# EAGLE design 2high (EAGLE 6.6.0)
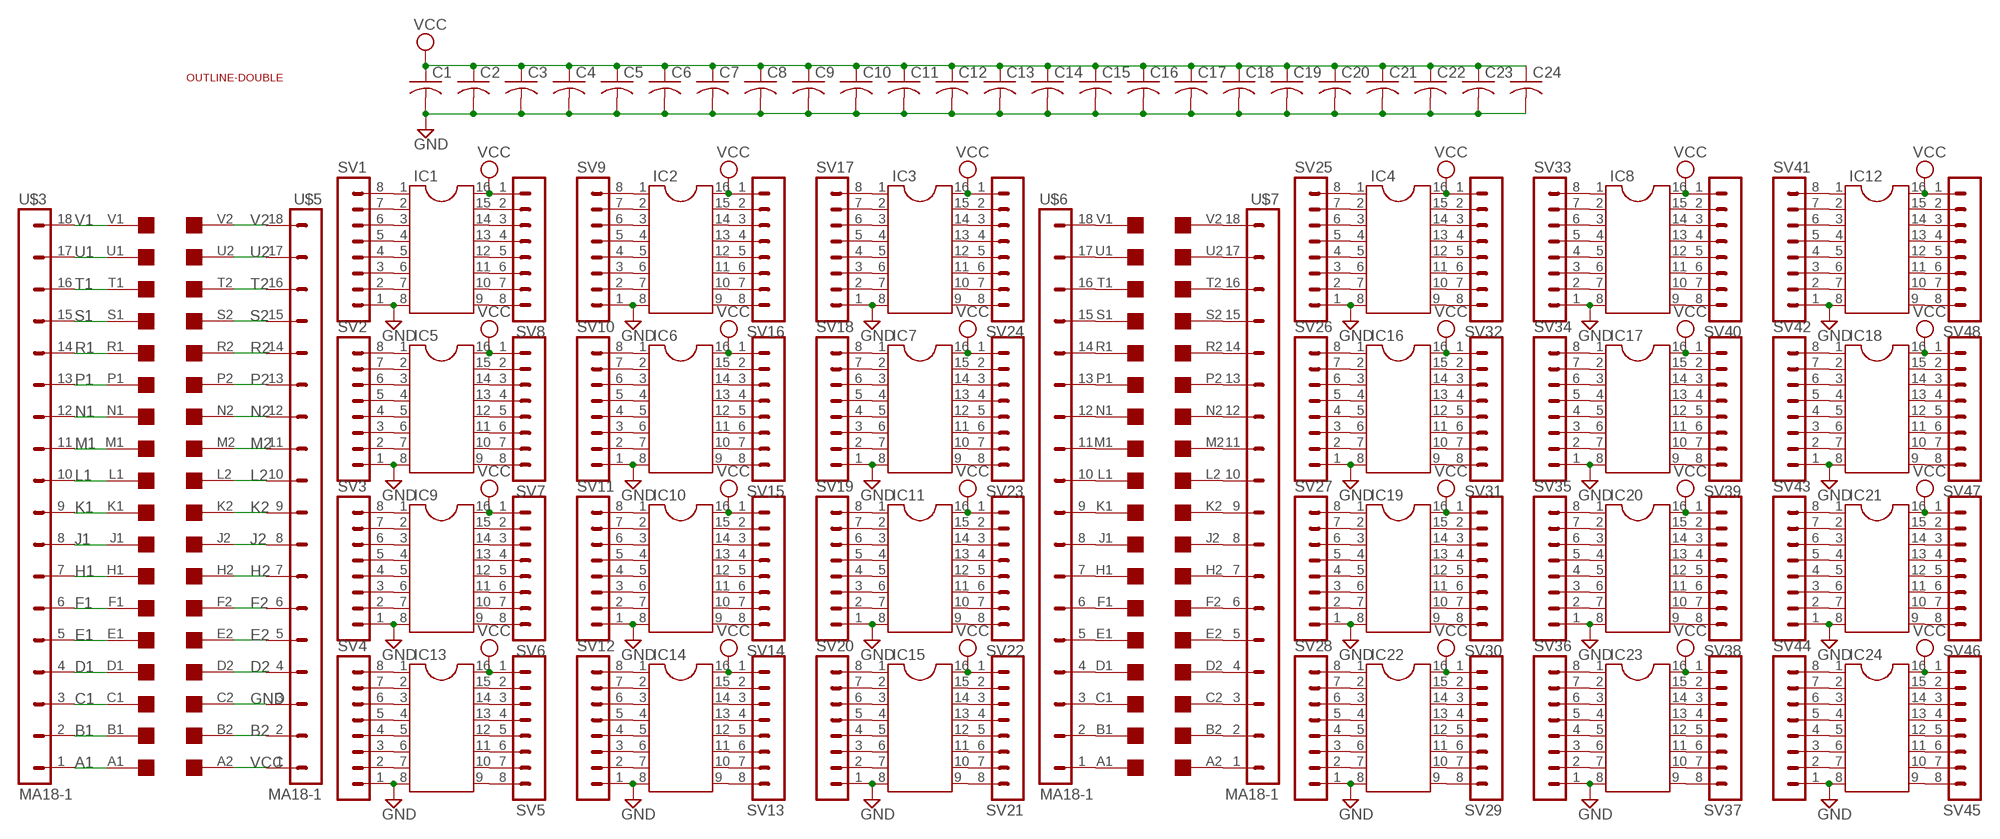
[diagram p0: schematic, sheet 1]

## Parts
C1  C-US050-025X075  [C050-025X075]
C2  C-US050-025X075  [C050-025X075]
C3  C-US050-025X075  [C050-025X075]
C4  C-US050-025X075  [C050-025X075]
C5  C-US050-025X075  [C050-025X075]
C6  C-US050-025X075  [C050-025X075]
C7  C-US050-025X075  [C050-025X075]
C8  C-US050-025X075  [C050-025X075]
C9  C-US050-025X075  [C050-025X075]
C10  C-US050-025X075  [C050-025X075]
C11  C-US050-025X075  [C050-025X075]
C12  C-US050-025X075  [C050-025X075]
C13  C-US050-025X075  [C050-025X075]
C14  C-US050-025X075  [C050-025X075]
C15  C-US050-025X075  [C050-025X075]
C16  C-US050-025X075  [C050-025X075]
C17  C-US050-025X075  [C050-025X075]
C18  C-US050-025X075  [C050-025X075]
C19  C-US050-025X075  [C050-025X075]
C20  C-US050-025X075  [C050-025X075]
C21  C-US050-025X075  [C050-025X075]
C22  C-US050-025X075  [C050-025X075]
C23  C-US050-025X075  [C050-025X075]
C24  C-US050-025X075  [C050-025X075]
IC1  DIL16  [DIL16]
IC2  DIL16  [DIL16]
IC3  DIL16  [DIL16]
IC4  DIL16  [DIL16]
IC5  DIL16  [DIL16]
IC6  DIL16  [DIL16]
IC7  DIL16  [DIL16]
IC8  DIL16  [DIL16]
IC9  DIL16  [DIL16]
IC10  DIL16  [DIL16]
IC11  DIL16  [DIL16]
IC12  DIL16  [DIL16]
IC13  DIL16  [DIL16]
IC14  DIL16  [DIL16]
IC15  DIL16  [DIL16]
IC16  DIL16  [DIL16]
IC17  DIL16  [DIL16]
IC18  DIL16  [DIL16]
IC19  DIL16  [DIL16]
IC20  DIL16  [DIL16]
IC21  DIL16  [DIL16]
IC22  DIL16  [DIL16]
IC23  DIL16  [DIL16]
IC24  DIL16  [DIL16]
SV1  MA08-1  [MA08-1]
SV2  MA08-1  [MA08-1]
SV3  MA08-1  [MA08-1]
SV4  MA08-1  [MA08-1]
SV5  MA08-1  [MA08-1]
SV6  MA08-1  [MA08-1]
SV7  MA08-1  [MA08-1]
SV8  MA08-1  [MA08-1]
SV9  MA08-1  [MA08-1]
SV10  MA08-1  [MA08-1]
SV11  MA08-1  [MA08-1]
SV12  MA08-1  [MA08-1]
SV13  MA08-1  [MA08-1]
SV14  MA08-1  [MA08-1]
SV15  MA08-1  [MA08-1]
SV16  MA08-1  [MA08-1]
SV17  MA08-1  [MA08-1]
SV18  MA08-1  [MA08-1]
SV19  MA08-1  [MA08-1]
SV20  MA08-1  [MA08-1]
SV21  MA08-1  [MA08-1]
SV22  MA08-1  [MA08-1]
SV23  MA08-1  [MA08-1]
SV24  MA08-1  [MA08-1]
SV25  MA08-1  [MA08-1]
SV26  MA08-1  [MA08-1]
SV27  MA08-1  [MA08-1]
SV28  MA08-1  [MA08-1]
SV29  MA08-1  [MA08-1]
SV30  MA08-1  [MA08-1]
SV31  MA08-1  [MA08-1]
SV32  MA08-1  [MA08-1]
SV33  MA08-1  [MA08-1]
SV34  MA08-1  [MA08-1]
SV35  MA08-1  [MA08-1]
SV36  MA08-1  [MA08-1]
SV37  MA08-1  [MA08-1]
SV38  MA08-1  [MA08-1]
SV39  MA08-1  [MA08-1]
SV40  MA08-1  [MA08-1]
SV41  MA08-1  [MA08-1]
SV42  MA08-1  [MA08-1]
SV43  MA08-1  [MA08-1]
SV44  MA08-1  [MA08-1]
SV45  MA08-1  [MA08-1]
SV46  MA08-1  [MA08-1]
SV47  MA08-1  [MA08-1]
SV48  MA08-1  [MA08-1]
U$1  OUTLINE-DOUBLE  [DOUBLE]
U$2  EDGE-2CONNECTOR  [EDGE-CON2]
U$3  MA18-1  [MA18-1]
U$4  EDGE-2CONNECTOR  [EDGE-CON2]
U$5  MA18-1  [MA18-1]
U$6  MA18-1  [MA18-1]
U$7  MA18-1  [MA18-1]

## Nets
A1: U$3.1 U$4.A1
B1: U$3.2 U$4.B1
B2: U$4.B2 U$5.2
C1: U$3.3 U$4.C1
D1: U$3.4 U$4.D1
D2: U$4.D2 U$5.4
E1: U$3.5 U$4.E1
E2: U$4.E2 U$5.5
F1: U$3.6 U$4.F1
F2: U$4.F2 U$5.6
GND: C1.2 C2.2 C3.2 C4.2 C5.2 C6.2 C7.2 C8.2 C9.2 C10.2 C11.2 C12.2 C13.2 C14.2 C15.2 C16.2 C17.2 C18.2 C19.2 C20.2 C21.2 C22.2 C23.2 C24.2 IC1.8 IC2.8 IC3.8 IC4.8 IC5.8 IC6.8 IC7.8 IC8.8 IC9.8 IC10.8 IC11.8 IC12.8 IC13.8 IC14.8 IC15.8 IC16.8 IC17.8 IC18.8 IC19.8 IC20.8 IC21.8 IC22.8 IC23.8 IC24.8 SV1.1 SV2.1 SV3.1 SV4.1 SV9.1 SV10.1 SV11.1 SV12.1 SV17.1 SV18.1 SV19.1 SV20.1 SV25.1 SV26.1 SV27.1 SV28.1 SV33.1 SV34.1 SV35.1 SV36.1 SV41.1 SV42.1 SV43.1 SV44.1 U$4.C2 U$5.3
H1: U$3.7 U$4.H1
H2: U$4.H2 U$5.7
J1: U$3.8 U$4.J1
J2: U$4.J2 U$5.8
K1: U$3.9 U$4.K1
K2: U$4.K2 U$5.9
L1: U$3.10 U$4.L1
L2: U$4.L2 U$5.10
M1: U$3.11 U$4.M1
M2: U$4.M2 U$5.11
N1: U$3.12 U$4.N1
N2: U$4.N2 U$5.12
N$1: IC1.7 SV1.2
N$2: IC1.6 SV1.3
N$3: IC1.5 SV1.4
N$4: IC1.4 SV1.5
N$5: IC1.3 SV1.6
N$6: IC1.2 SV1.7
N$7: IC1.1 SV1.8
N$8: IC5.7 SV2.2
N$9: IC5.6 SV2.3
N$10: IC5.5 SV2.4
N$11: IC5.4 SV2.5
N$12: IC5.3 SV2.6
N$13: IC5.2 SV2.7
N$14: IC5.1 SV2.8
N$15: IC9.7 SV3.2
N$16: IC9.6 SV3.3
N$17: IC9.5 SV3.4
N$18: IC9.4 SV3.5
N$19: IC9.3 SV3.6
N$20: IC9.2 SV3.7
N$21: IC9.1 SV3.8
N$22: IC13.7 SV4.2
N$23: IC13.6 SV4.3
N$24: IC13.5 SV4.4
N$25: IC13.4 SV4.5
N$26: IC13.3 SV4.6
N$27: IC13.2 SV4.7
N$28: IC13.1 SV4.8
N$29: IC2.1 SV9.8
N$30: IC2.2 SV9.7
N$31: IC2.3 SV9.6
N$32: IC2.4 SV9.5
N$33: IC2.5 SV9.4
N$34: IC2.6 SV9.3
N$35: IC2.7 SV9.2
N$36: IC6.1 SV10.8
N$37: IC6.2 SV10.7
N$38: IC6.3 SV10.6
N$39: IC6.4 SV10.5
N$40: IC6.5 SV10.4
N$41: IC6.6 SV10.3
N$42: IC6.7 SV10.2
N$43: IC10.1 SV11.8
N$44: IC10.2 SV11.7
N$45: IC10.3 SV11.6
N$46: IC10.4 SV11.5
N$47: IC10.5 SV11.4
N$48: IC10.6 SV11.3
N$49: IC10.7 SV11.2
N$50: IC14.1 SV12.8
N$51: IC14.2 SV12.7
N$52: IC14.3 SV12.6
N$53: IC14.4 SV12.5
N$54: IC14.5 SV12.4
N$55: IC14.6 SV12.3
N$56: IC14.7 SV12.2
N$57: IC6.15 SV15.2
N$58: IC6.14 SV15.3
N$59: IC6.13 SV15.4
N$60: IC6.12 SV15.5
N$61: IC6.11 SV15.6
N$62: IC6.10 SV15.7
N$63: IC6.9 SV15.8
N$64: IC10.15 SV14.2
N$65: IC10.14 SV14.3
N$66: IC10.13 SV14.4
N$67: IC10.12 SV14.5
N$68: IC10.11 SV14.6
N$69: IC10.10 SV14.7
N$70: IC10.9 SV14.8
N$71: IC1.9 SV8.8
N$72: IC1.10 SV8.7
N$73: IC1.11 SV8.6
N$74: IC1.12 SV8.5
N$75: IC1.13 SV8.4
N$76: IC1.14 SV8.3
N$77: IC1.15 SV8.2
N$78: IC5.9 SV7.8
N$79: IC5.10 SV7.7
N$80: IC5.11 SV7.6
N$81: IC5.12 SV7.5
N$82: IC5.13 SV7.4
N$83: IC5.14 SV7.3
N$84: IC5.15 SV7.2
N$85: IC2.15 SV16.2
N$86: IC2.14 SV16.3
N$87: IC2.13 SV16.4
N$88: IC2.12 SV16.5
N$89: IC2.11 SV16.6
N$90: IC2.10 SV16.7
N$91: IC2.9 SV16.8
N$92: IC13.15 SV5.2
N$93: IC13.14 SV5.3
N$94: IC13.13 SV5.4
N$95: IC13.12 SV5.5
N$96: IC13.11 SV5.6
N$97: IC13.10 SV5.7
N$98: IC13.9 SV5.8
N$99: IC9.15 SV6.2
N$100: IC9.14 SV6.3
N$101: IC9.13 SV6.4
N$102: IC9.12 SV6.5
N$103: IC9.11 SV6.6
N$104: IC9.10 SV6.7
N$105: IC9.9 SV6.8
N$106: IC14.15 SV13.2
N$107: IC14.14 SV13.3
N$108: IC14.13 SV13.4
N$109: IC14.12 SV13.5
N$110: IC14.11 SV13.6
N$111: IC14.10 SV13.7
N$112: IC14.9 SV13.8
N$113: IC3.7 SV17.2
N$114: IC3.6 SV17.3
N$115: IC3.5 SV17.4
N$116: IC3.4 SV17.5
N$117: IC3.3 SV17.6
N$118: IC3.2 SV17.7
N$119: IC3.1 SV17.8
N$120: IC7.7 SV18.2
N$121: IC7.6 SV18.3
N$122: IC7.5 SV18.4
N$123: IC7.4 SV18.5
N$124: IC7.3 SV18.6
N$125: IC7.2 SV18.7
N$126: IC7.1 SV18.8
N$127: IC11.7 SV19.2
N$128: IC11.6 SV19.3
N$129: IC11.5 SV19.4
N$130: IC11.4 SV19.5
N$131: IC11.3 SV19.6
N$132: IC11.2 SV19.7
N$133: IC11.1 SV19.8
N$134: IC15.7 SV20.2
N$135: IC15.6 SV20.3
N$136: IC15.5 SV20.4
N$137: IC15.4 SV20.5
N$138: IC15.3 SV20.6
N$139: IC15.2 SV20.7
N$140: IC15.1 SV20.8
N$141: IC15.15 SV21.2
N$142: IC15.14 SV21.3
N$143: IC15.13 SV21.4
N$144: IC15.12 SV21.5
N$145: IC15.11 SV21.6
N$146: IC15.10 SV21.7
N$147: IC15.9 SV21.8
N$148: IC11.15 SV22.2
N$149: IC11.14 SV22.3
N$150: IC11.13 SV22.4
N$151: IC11.12 SV22.5
N$152: IC11.11 SV22.6
N$153: IC11.10 SV22.7
N$154: IC11.9 SV22.8
N$155: IC7.15 SV23.2
N$156: IC7.14 SV23.3
N$157: IC7.13 SV23.4
N$158: IC7.12 SV23.5
N$159: IC7.11 SV23.6
N$160: IC7.10 SV23.7
N$161: IC7.9 SV23.8
N$162: IC3.15 SV24.2
N$163: IC3.14 SV24.3
N$164: IC3.13 SV24.4
N$165: IC3.12 SV24.5
N$166: IC3.11 SV24.6
N$167: IC3.10 SV24.7
N$168: IC3.9 SV24.8
N$169: U$2.A2 U$7.1
N$170: U$2.A1 U$6.1
N$171: U$2.B1 U$6.2
N$172: U$2.B2 U$7.2
N$173: U$2.C2 U$7.3
N$174: U$2.C1 U$6.3
N$175: U$2.D1 U$6.4
N$176: U$2.D2 U$7.4
N$177: U$2.E2 U$7.5
N$178: U$2.E1 U$6.5
N$179: U$2.F1 U$6.6
N$180: U$2.F2 U$7.6
N$181: U$2.H2 U$7.7
N$182: U$2.H1 U$6.7
N$183: U$2.J1 U$6.8
N$184: U$2.J2 U$7.8
N$185: U$2.K2 U$7.9
N$186: U$2.K1 U$6.9
N$187: U$2.L1 U$6.10
N$188: U$2.L2 U$7.10
N$189: U$2.M2 U$7.11
N$190: U$2.M1 U$6.11
N$191: U$2.N1 U$6.12
N$192: U$2.P1 U$6.13
N$193: U$2.P2 U$7.13
N$194: U$2.N2 U$7.12
N$195: U$2.V1 U$6.18
N$196: U$2.U1 U$6.17
N$197: U$2.T1 U$6.16
N$198: U$2.S1 U$6.15
N$199: U$2.R1 U$6.14
N$200: U$2.V2 U$7.18
N$201: U$2.U2 U$7.17
N$202: U$2.T2 U$7.16
N$203: U$2.S2 U$7.15
N$204: U$2.R2 U$7.14
N$205: IC4.7 SV25.2
N$206: IC4.6 SV25.3
N$207: IC4.5 SV25.4
N$208: IC4.4 SV25.5
N$209: IC4.3 SV25.6
N$210: IC4.2 SV25.7
N$211: IC4.1 SV25.8
N$212: IC16.7 SV26.2
N$213: IC16.6 SV26.3
N$214: IC16.5 SV26.4
N$215: IC16.4 SV26.5
N$216: IC16.3 SV26.6
N$217: IC16.2 SV26.7
N$218: IC16.1 SV26.8
N$219: IC19.7 SV27.2
N$220: IC19.6 SV27.3
N$221: IC19.5 SV27.4
N$222: IC19.4 SV27.5
N$223: IC19.3 SV27.6
N$224: IC19.2 SV27.7
N$225: IC19.1 SV27.8
N$226: IC22.7 SV28.2
N$227: IC22.6 SV28.3
N$228: IC22.5 SV28.4
N$229: IC22.4 SV28.5
N$230: IC22.3 SV28.6
N$231: IC22.2 SV28.7
N$232: IC22.1 SV28.8
N$233: IC8.1 SV33.8
N$234: IC8.2 SV33.7
N$235: IC8.3 SV33.6
N$236: IC8.4 SV33.5
N$237: IC8.5 SV33.4
N$238: IC8.6 SV33.3
N$239: IC8.7 SV33.2
N$240: IC17.1 SV34.8
N$241: IC17.2 SV34.7
N$242: IC17.3 SV34.6
N$243: IC17.4 SV34.5
N$244: IC17.5 SV34.4
N$245: IC17.6 SV34.3
N$246: IC17.7 SV34.2
N$247: IC20.1 SV35.8
N$248: IC20.2 SV35.7
N$249: IC20.3 SV35.6
N$250: IC20.4 SV35.5
N$251: IC20.5 SV35.4
N$252: IC20.6 SV35.3
N$253: IC20.7 SV35.2
N$254: IC23.1 SV36.8
N$255: IC23.2 SV36.7
N$256: IC23.3 SV36.6
N$257: IC23.4 SV36.5
N$258: IC23.5 SV36.4
N$259: IC23.6 SV36.3
N$260: IC23.7 SV36.2
N$261: IC17.15 SV39.2
N$262: IC17.14 SV39.3
N$263: IC17.13 SV39.4
N$264: IC17.12 SV39.5
N$265: IC17.11 SV39.6
N$266: IC17.10 SV39.7
N$267: IC17.9 SV39.8
N$268: IC20.15 SV38.2
N$269: IC20.14 SV38.3
N$270: IC20.13 SV38.4
N$271: IC20.12 SV38.5
N$272: IC20.11 SV38.6
N$273: IC20.10 SV38.7
N$274: IC20.9 SV38.8
N$275: IC4.9 SV32.8
N$276: IC4.10 SV32.7
N$277: IC4.11 SV32.6
N$278: IC4.12 SV32.5
N$279: IC4.13 SV32.4
N$280: IC4.14 SV32.3
N$281: IC4.15 SV32.2
N$282: IC16.9 SV31.8
N$283: IC16.10 SV31.7
N$284: IC16.11 SV31.6
N$285: IC16.12 SV31.5
N$286: IC16.13 SV31.4
N$287: IC16.14 SV31.3
N$288: IC16.15 SV31.2
N$289: IC8.15 SV40.2
N$290: IC8.14 SV40.3
N$291: IC8.13 SV40.4
N$292: IC8.12 SV40.5
N$293: IC8.11 SV40.6
N$294: IC8.10 SV40.7
N$295: IC8.9 SV40.8
N$296: IC22.15 SV29.2
N$297: IC22.14 SV29.3
N$298: IC22.13 SV29.4
N$299: IC22.12 SV29.5
N$300: IC22.11 SV29.6
N$301: IC22.10 SV29.7
N$302: IC22.9 SV29.8
N$303: IC19.15 SV30.2
N$304: IC19.14 SV30.3
N$305: IC19.13 SV30.4
N$306: IC19.12 SV30.5
N$307: IC19.11 SV30.6
N$308: IC19.10 SV30.7
N$309: IC19.9 SV30.8
N$310: IC23.15 SV37.2
N$311: IC23.14 SV37.3
N$312: IC23.13 SV37.4
N$313: IC23.12 SV37.5
N$314: IC23.11 SV37.6
N$315: IC23.10 SV37.7
N$316: IC23.9 SV37.8
N$317: IC12.7 SV41.2
N$318: IC12.6 SV41.3
N$319: IC12.5 SV41.4
N$320: IC12.4 SV41.5
N$321: IC12.3 SV41.6
N$322: IC12.2 SV41.7
N$323: IC12.1 SV41.8
N$324: IC18.7 SV42.2
N$325: IC18.6 SV42.3
N$326: IC18.5 SV42.4
N$327: IC18.4 SV42.5
N$328: IC18.3 SV42.6
N$329: IC18.2 SV42.7
N$330: IC18.1 SV42.8
N$331: IC21.7 SV43.2
N$332: IC21.6 SV43.3
N$333: IC21.5 SV43.4
N$334: IC21.4 SV43.5
N$335: IC21.3 SV43.6
N$336: IC21.2 SV43.7
N$337: IC21.1 SV43.8
N$338: IC24.7 SV44.2
N$339: IC24.6 SV44.3
N$340: IC24.5 SV44.4
N$341: IC24.4 SV44.5
N$342: IC24.3 SV44.6
N$343: IC24.2 SV44.7
N$344: IC24.1 SV44.8
N$345: IC24.15 SV45.2
N$346: IC24.14 SV45.3
N$347: IC24.13 SV45.4
N$348: IC24.12 SV45.5
N$349: IC24.11 SV45.6
N$350: IC24.10 SV45.7
N$351: IC24.9 SV45.8
N$352: IC21.15 SV46.2
N$353: IC21.14 SV46.3
N$354: IC21.13 SV46.4
N$355: IC21.12 SV46.5
N$356: IC21.11 SV46.6
N$357: IC21.10 SV46.7
N$358: IC21.9 SV46.8
N$359: IC18.15 SV47.2
N$360: IC18.14 SV47.3
N$361: IC18.13 SV47.4
N$362: IC18.12 SV47.5
N$363: IC18.11 SV47.6
N$364: IC18.10 SV47.7
N$365: IC18.9 SV47.8
N$366: IC12.15 SV48.2
N$367: IC12.14 SV48.3
N$368: IC12.13 SV48.4
N$369: IC12.12 SV48.5
N$370: IC12.11 SV48.6
N$371: IC12.10 SV48.7
N$372: IC12.9 SV48.8
P1: U$3.13 U$4.P1
P2: U$4.P2 U$5.13
R1: U$3.14 U$4.R1
R2: U$4.R2 U$5.14
S1: U$3.15 U$4.S1
S2: U$4.S2 U$5.15
T1: U$3.16 U$4.T1
T2: U$4.T2 U$5.16
U1: U$3.17 U$4.U1
U2: U$4.U2 U$5.17
V1: U$3.18 U$4.V1
V2: U$4.V2 U$5.18
VCC: C1.1 C2.1 C3.1 C4.1 C5.1 C6.1 C7.1 C8.1 C9.1 C10.1 C11.1 C12.1 C13.1 C14.1 C15.1 C16.1 C17.1 C18.1 C19.1 C20.1 C21.1 C22.1 C23.1 C24.1 IC1.16 IC2.16 IC3.16 IC4.16 IC5.16 IC6.16 IC7.16 IC8.16 IC9.16 IC10.16 IC11.16 IC12.16 IC13.16 IC14.16 IC15.16 IC16.16 IC17.16 IC18.16 IC19.16 IC20.16 IC21.16 IC22.16 IC23.16 IC24.16 SV5.1 SV6.1 SV7.1 SV8.1 SV13.1 SV14.1 SV15.1 SV16.1 SV21.1 SV22.1 SV23.1 SV24.1 SV29.1 SV30.1 SV31.1 SV32.1 SV37.1 SV38.1 SV39.1 SV40.1 SV45.1 SV46.1 SV47.1 SV48.1 U$4.A2 U$5.1

## Library data of the parts
C1-C24 = rcl:C-US: CAPACITOR, American symbol
IC1-IC24 = ic-package:DIL16: Dual In Line / Socket
SV1-SV48 = con-lstb:MA08-1: PIN HEADER; OC_FARNELL: unknown; OC_NEWARK: unknown
U$1 = dec-con:OUTLINE-*: Board outlines for DEC boards.
U$2 U$4 = dec-con:EDGE-2: Double-Sided DEC edge connector.
U$3 U$5-U$7 = dec-con:MA18-1

## Board
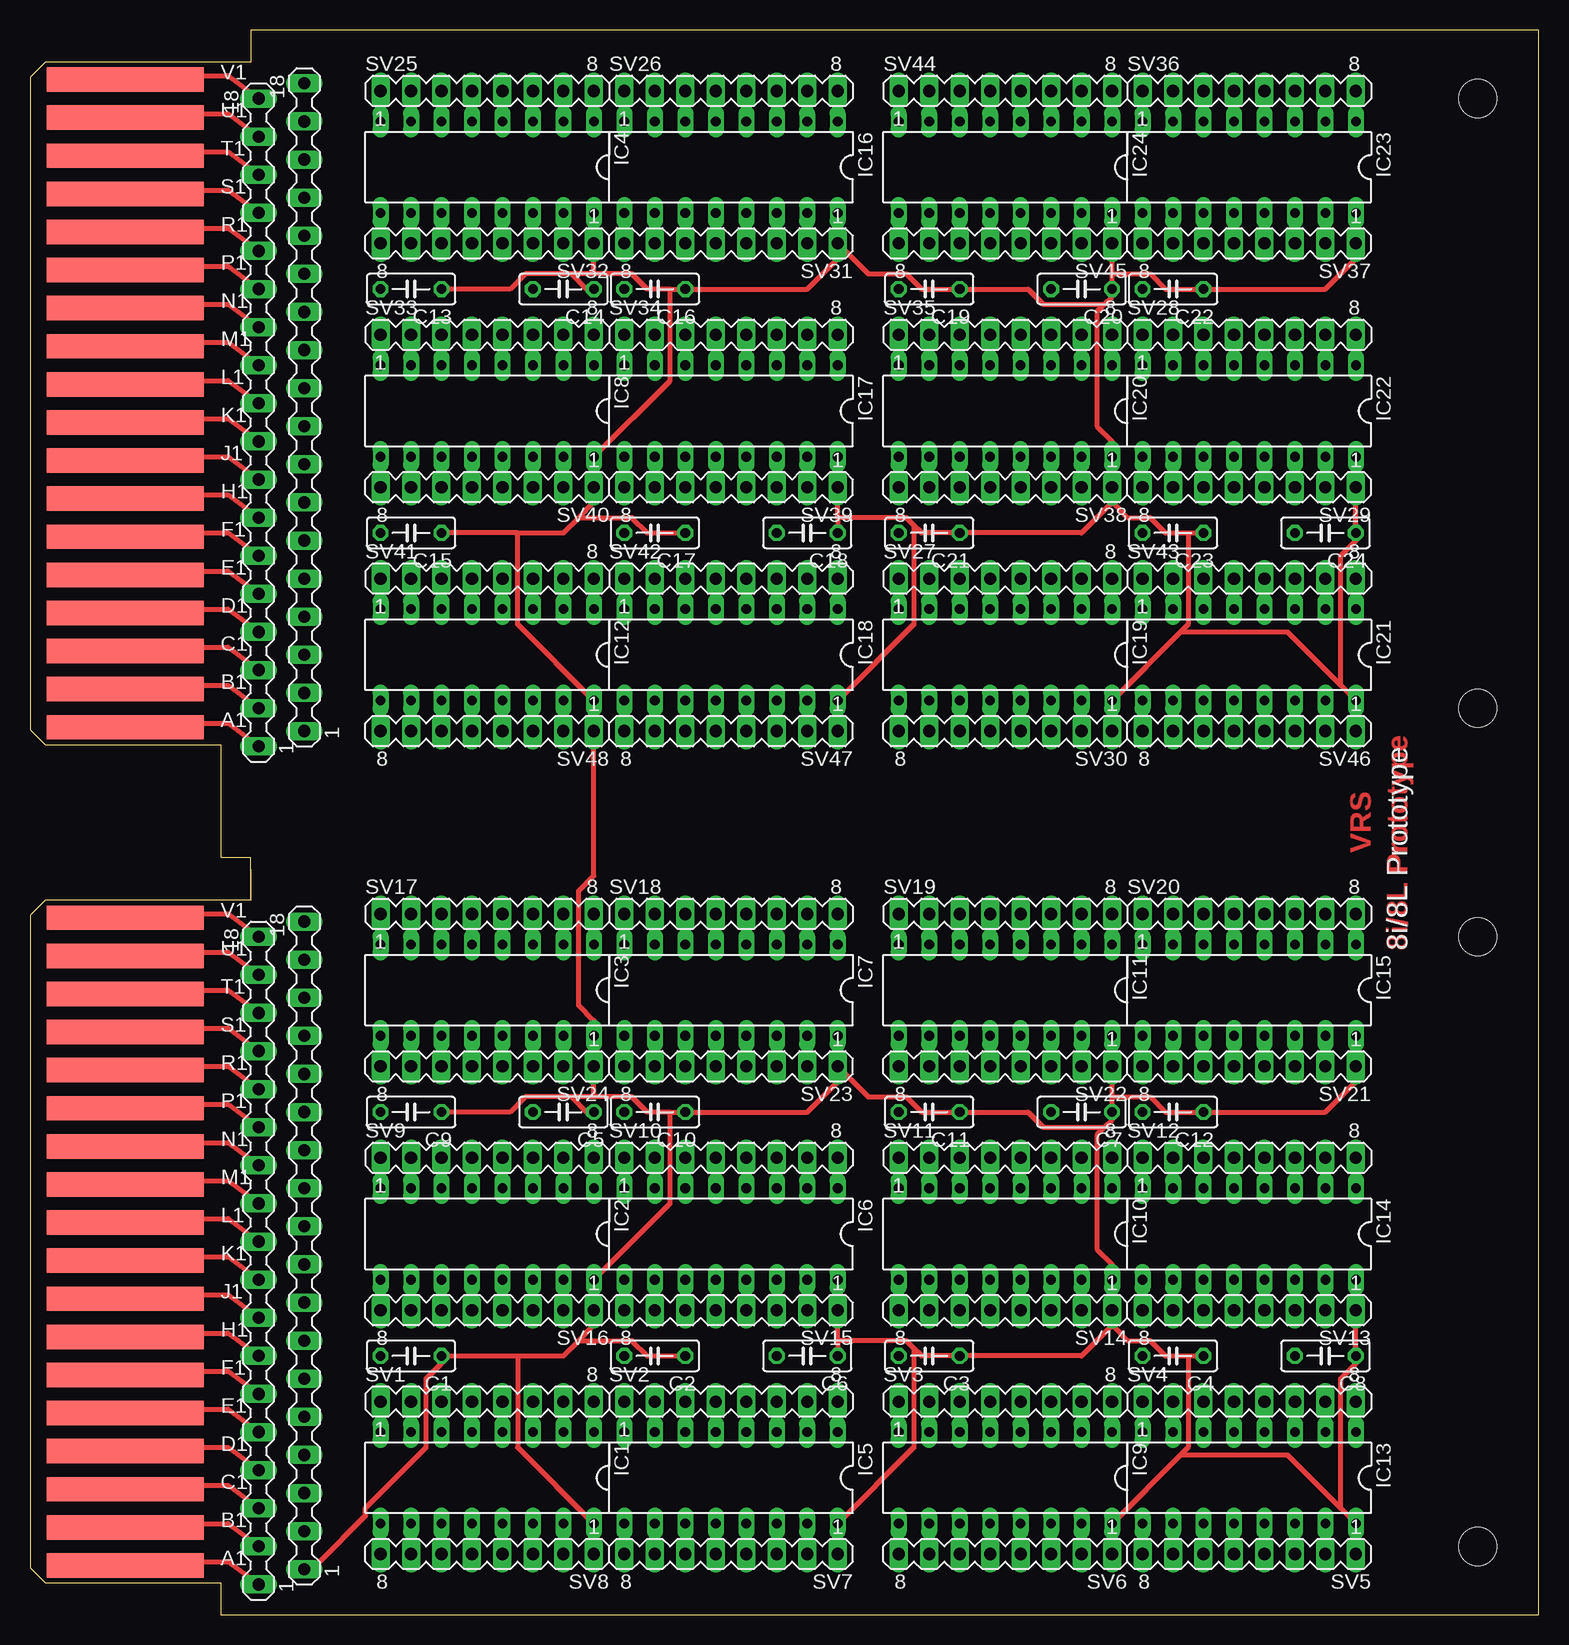
[diagram p1: board, top side]
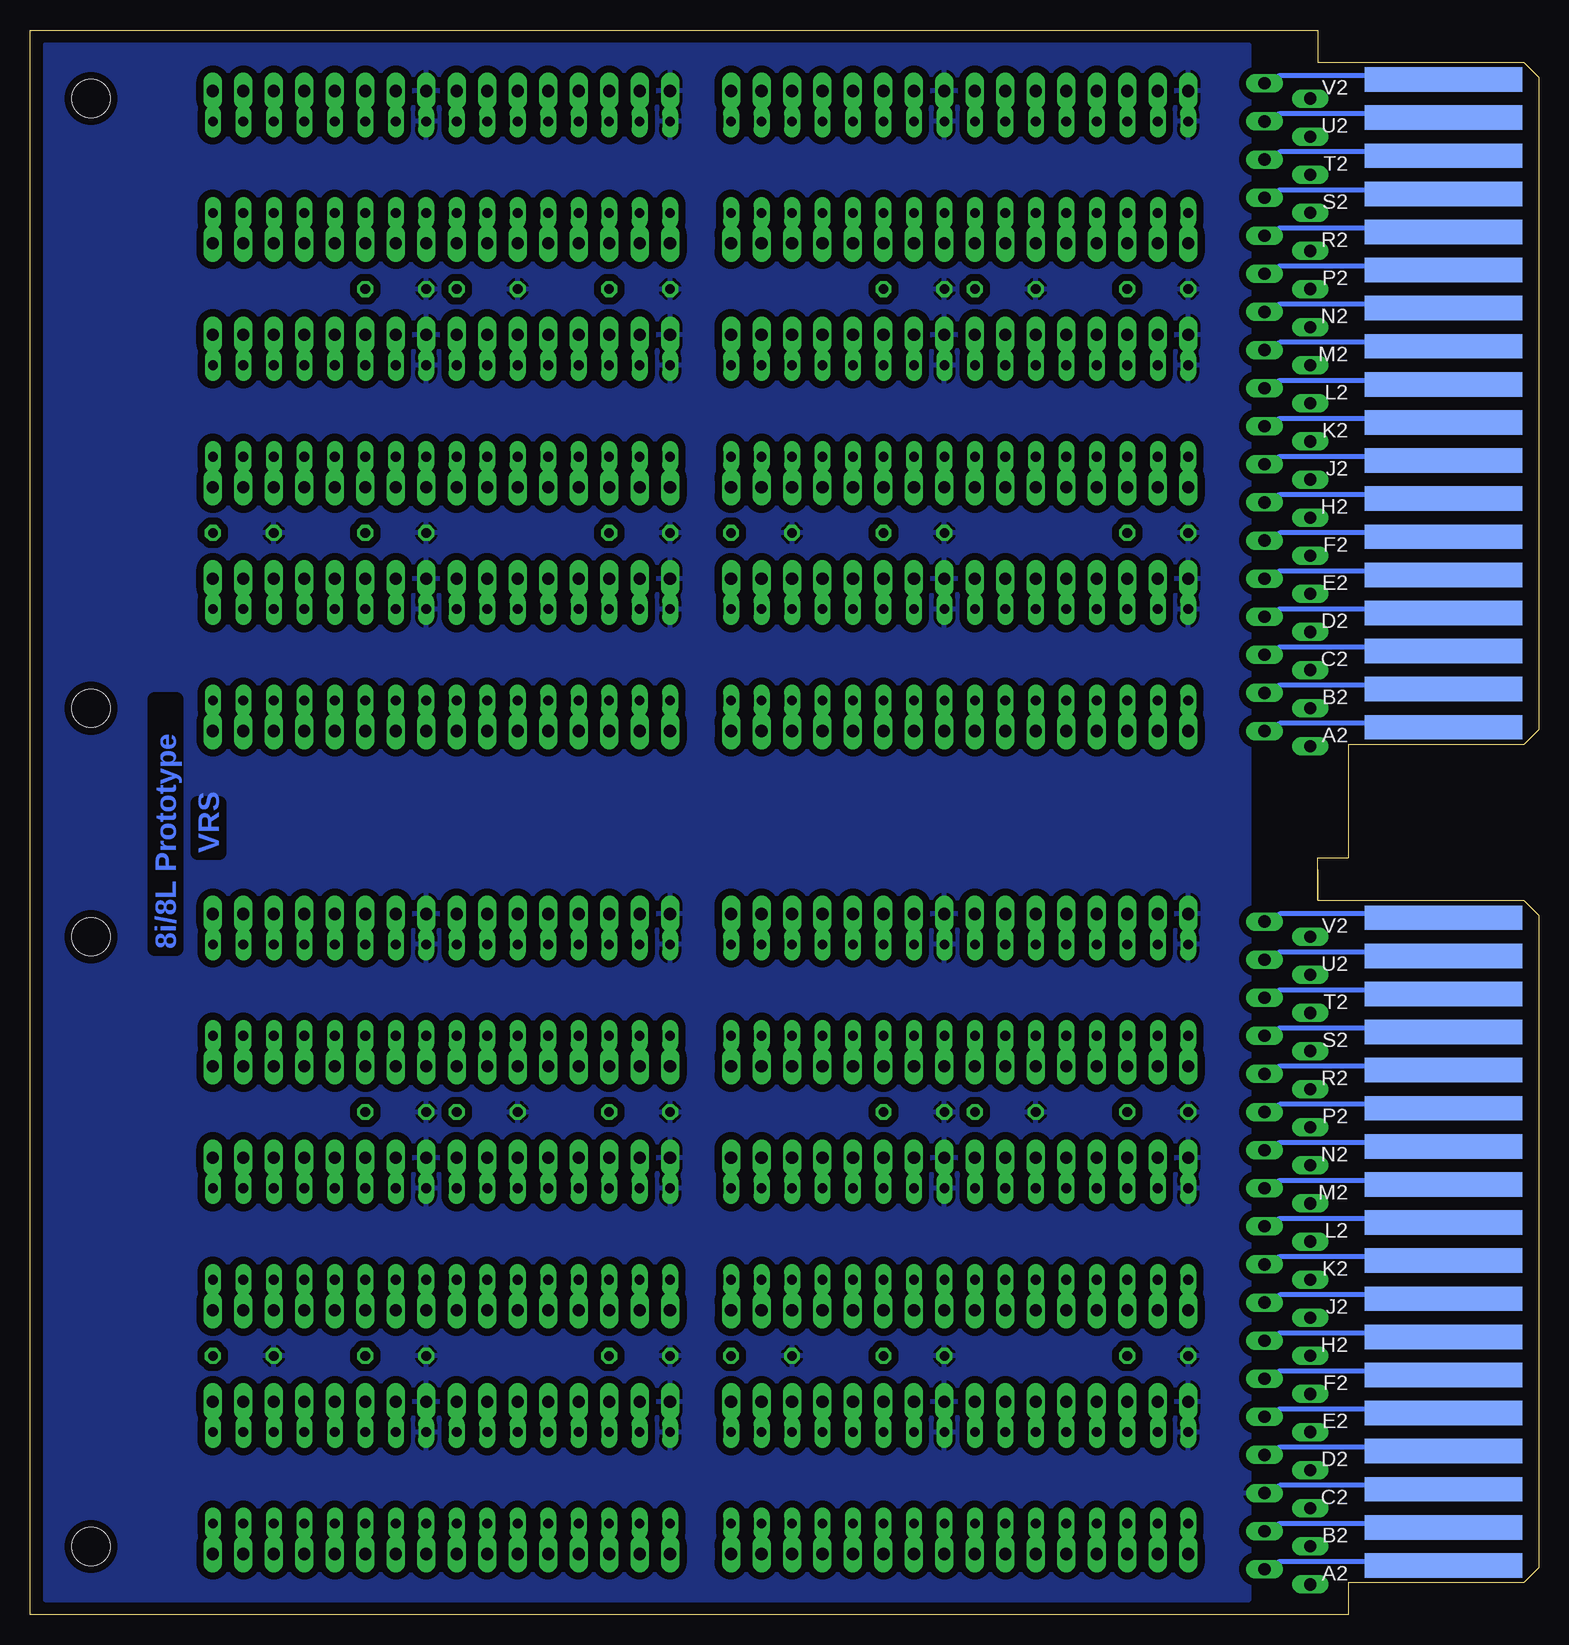
[diagram p2: board, bottom side, seen from below]

Size 125.73 x 132.08 mm. Coordinates in mm from the lower left corner, seen from the top.
Copper layers (1+16): Top 0.035mm / dielectric 1.5mm / Bottom 0.035mm
Design rules "16mils": minimum track width 16mil, minimum drill 32mil, track to track 15mil, track to pad 10mil, pad to pad 10mil, via to via 10mil, smd to smd 10mil, copper to edge 13mil, drill to drill 10mil, minimum pad ring 10mil, minimum via ring 8mil, stop-mask expansion 0mil, vias tented up to drill 0mil, thermal gap 10mil

### Footprints (pad centres in the part's own frame; a part is rotated, then mirrored left to right if it is on the bottom)
C050-025X075 = drill 0.813 octagon: 1 -2.54,0; 2 2.54,0
DIL16 = drill 0.813 long: 1 -8.89,-3.81; 2 -6.35,-3.81; 3 -3.81,-3.81; 4 -1.27,-3.81; 5 1.27,-3.81; 6 3.81,-3.81; 7 6.35,-3.81; 8 8.89,-3.81; 9 8.89,3.81; 10 6.35,3.81; 11 3.81,3.81; 12 1.27,3.81; 13 -1.27,3.81; 14 -3.81,3.81; 15 -6.35,3.81; 16 -8.89,3.81
MA08-1 = drill 1.016 long: 1 -8.89,0; 2 -6.35,0; 3 -3.81,0; 4 -1.27,0; 5 1.27,0; 6 3.81,0; 7 6.35,0; 8 8.89,0
DOUBLE = hole 3.175: 120.65,56.515; 120.65,5.715; 120.65,75.565; 120.65,126.365
EDGE-CON2 = smd 13.106 x 2.032: A1 7.938,4.128; B1 7.938,7.303; C1 7.938,10.477; D1 7.938,13.652; E1 7.938,16.828; F1 7.938,20.003; H1 7.938,23.177; J1 7.938,26.352; K1 7.938,29.527; L1 7.938,32.703; M1 7.938,35.877; N1 7.938,39.053; P1 7.938,42.227; R1 7.938,45.403; S1 7.938,48.578; T1 7.938,51.752; U1 7.938,54.928; V1 7.938,58.102 | smd 13.106 x 2.032 bottom: A2 7.938,4.128; B2 7.938,7.303; C2 7.938,10.477; D2 7.938,13.652; E2 7.938,16.828; F2 7.938,20.003; H2 7.938,23.177; J2 7.938,26.352; K2 7.938,29.527; L2 7.938,32.703; M2 7.938,35.877; N2 7.938,39.053; P2 7.938,42.227; R2 7.938,45.403; S2 7.938,48.578; T2 7.938,51.752; U2 7.938,54.928; V2 7.938,58.102
MA18-1 = drill 1.016 long: 1 -25.4,0; 2 -22.225,0; 3 -19.05,0; 4 -15.875,0; 5 -12.7,0; 6 -9.525,0; 7 -6.35,0; 8 -3.175,0; 9 0,0; 10 3.175,0; 11 6.35,0; 12 9.525,0; 13 12.7,0; 14 15.875,0; 15 19.05,0; 16 22.225,0; 17 25.4,0; 18 28.575,0

### Placement (x,y rotation side)
C1  31.75,21.59 180 top
C2  52.07,21.59 180 top
C3  74.93,21.59 180 top
C4  95.25,21.59 180 top
C5  44.45,41.91 180 top
C6  64.77,21.59 180 top
C7  87.63,41.91 180 top
C8  107.95,21.59 180 top
C9  31.75,41.91 180 top
C10  52.07,41.91 180 top
C11  74.93,41.91 180 top
C12  95.25,41.91 180 top
C13  31.75,110.49 180 top
C14  44.45,110.49 180 top
C15  31.75,90.17 180 top
C16  52.07,110.49 180 top
C17  52.07,90.17 180 top
C18  64.77,90.17 180 top
C19  74.93,110.49 180 top
C20  87.63,110.49 180 top
C21  74.93,90.17 180 top
C22  95.25,110.49 180 top
C23  95.25,90.17 180 top
C24  107.95,90.17 180 top
IC1  38.1,11.43 180 top
IC2  38.1,31.75 180 top
IC3  38.1,52.07 180 top
IC4  38.1,120.65 180 top
IC5  58.42,11.43 180 top
IC6  58.42,31.75 180 top
IC7  58.42,52.07 180 top
IC8  38.1,100.33 180 top
IC9  81.28,11.43 180 top
IC10  81.28,31.75 180 top
IC11  81.28,52.07 180 top
IC12  38.1,80.01 180 top
IC13  101.6,11.43 180 top
IC14  101.6,31.75 180 top
IC15  101.6,52.07 180 top
IC16  58.42,120.65 180 top
IC17  58.42,100.33 180 top
IC18  58.42,80.01 180 top
IC19  81.28,80.01 180 top
IC20  81.28,100.33 180 top
IC21  101.6,80.01 180 top
IC22  101.6,100.33 180 top
IC23  101.6,120.65 180 top
IC24  81.28,120.65 180 top
SV1  38.1,17.78 0 top
SV2  58.42,17.78 0 top
SV3  81.28,17.78 0 top
SV4  101.6,17.78 0 top
SV5  101.6,5.08 180 top
SV6  81.28,5.08 180 top
SV7  58.42,5.08 180 top
SV8  38.1,5.08 180 top
SV9  38.1,38.1 0 top
SV10  58.42,38.1 0 top
SV11  81.28,38.1 0 top
SV12  101.6,38.1 0 top
SV13  101.6,25.4 180 top
SV14  81.28,25.4 180 top
SV15  58.42,25.4 180 top
SV16  38.1,25.4 180 top
SV17  38.1,58.42 0 top
SV18  58.42,58.42 0 top
SV19  81.28,58.42 0 top
SV20  101.6,58.42 0 top
SV21  101.6,45.72 180 top
SV22  81.28,45.72 180 top
SV23  58.42,45.72 180 top
SV24  38.1,45.72 180 top
SV25  38.1,127 0 top
SV26  58.42,127 0 top
SV27  81.28,86.36 0 top
SV28  101.6,106.68 0 top
SV29  101.6,93.98 180 top
SV30  81.28,73.66 180 top
SV31  58.42,114.3 180 top
SV32  38.1,114.3 180 top
SV33  38.1,106.68 0 top
SV34  58.42,106.68 0 top
SV35  81.28,106.68 0 top
SV36  101.6,127 0 top
SV37  101.6,114.3 180 top
SV38  81.28,93.98 180 top
SV39  58.42,93.98 180 top
SV40  38.1,93.98 180 top
SV41  38.1,86.36 0 top
SV42  58.42,86.36 0 top
SV43  101.6,86.36 0 top
SV44  81.28,127 0 top
SV45  81.28,114.3 180 top
SV46  101.6,73.66 180 top
SV47  58.42,73.66 180 top
SV48  38.1,73.66 180 top
U$1  0,0 0 top
U$2  0,69.85 0 top
U$3  19.05,27.94 90 top
U$4  0,0 0 top
U$5  22.86,29.21 90 top
U$6  19.05,97.79 90 top
U$7  22.86,99.06 90 top

### Tracks (layer width: path | path; a pad name or v marks a point on that pad's centre or on a via)
A1
  Top 0.406: U$3.1 16.51,4.45 13.97,4.45 U$4.A1
B1
  Top 0.406: U$3.2 16.51,7.62 13.97,7.62 U$4.B1
B2
  Bottom 0.406: U$5.2 21.59,7.62 13.97,7.62 U$4.B2
C1
  Top 0.406: U$3.3 16.51,10.79 13.97,10.79 U$4.C1
D1
  Top 0.406: U$3.4 16.51,13.97 13.97,13.97 U$4.D1
D2
  Bottom 0.406: U$5.4 21.59,13.97 13.97,13.97 U$4.D2
E1
  Top 0.406: U$3.5 16.51,17.14 13.97,17.14 U$4.E1
E2
  Bottom 0.406: U$5.5 21.59,17.14 13.97,17.14 U$4.E2
F1
  Top 0.406: U$3.6 16.51,20.32 13.97,20.32 U$4.F1
F2
  Bottom 0.406: U$5.6 21.59,20.32 13.97,20.32 U$4.F2
GND
  Bottom 0.406: 24.13,10.35 24.13,10.16 U$5.3 21.59,10.79 13.97,10.79 U$4.C2
  pour Bottom (isolate 0.61): 24.13,130.81 124.46,130.81 124.46,1.27 24.13,1.27
H1
  Top 0.406: U$3.7 16.51,23.5 13.97,23.5 U$4.H1
H2
  Bottom 0.406: U$5.7 21.59,23.5 13.97,23.5 U$4.H2
J1
  Top 0.406: U$3.8 16.51,26.67 13.97,26.67 U$4.J1
J2
  Bottom 0.406: U$5.8 21.59,26.67 13.97,26.67 U$4.J2
K1
  Top 0.406: U$3.9 16.51,29.84 13.97,29.84 U$4.K1
K2
  Bottom 0.406: U$5.9 21.59,29.84 13.97,29.84 U$4.K2
L1
  Top 0.406: U$3.10 16.51,33.02 13.97,33.02 U$4.L1
L2
  Bottom 0.406: U$5.10 21.59,33.02 13.97,33.02 U$4.L2
M1
  Top 0.406: U$3.11 16.51,36.2 13.97,36.2 U$4.M1
M2
  Bottom 0.406: U$5.11 21.59,36.2 13.97,36.2 U$4.M2
N1
  Top 0.406: U$3.12 16.51,39.37 13.97,39.37 U$4.N1
N2
  Bottom 0.406: U$5.12 21.59,39.37 13.97,39.37 U$4.N2
N$1
  Bottom 0.406: IC1.7 SV1.2
N$2
  Bottom 0.406: IC1.6 SV1.3
N$3
  Bottom 0.406: IC1.5 SV1.4
N$4
  Bottom 0.406: IC1.4 SV1.5
N$5
  Bottom 0.406: IC1.3 SV1.6
N$6
  Bottom 0.406: IC1.2 SV1.7
N$7
  Bottom 0.406: IC1.1 SV1.8
N$8
  Bottom 0.406: IC5.7 SV2.2
N$9
  Bottom 0.406: IC5.6 SV2.3
N$10
  Bottom 0.406: IC5.5 SV2.4
N$11
  Bottom 0.406: IC5.4 SV2.5
N$12
  Bottom 0.406: IC5.3 SV2.6
N$13
  Bottom 0.406: IC5.2 SV2.7
N$14
  Bottom 0.406: IC5.1 SV2.8
N$15
  Bottom 0.406: IC9.7 SV3.2
N$16
  Bottom 0.406: IC9.6 SV3.3
N$17
  Bottom 0.406: IC9.5 SV3.4
N$18
  Bottom 0.406: IC9.4 SV3.5
N$19
  Bottom 0.406: IC9.3 SV3.6
N$20
  Bottom 0.406: IC9.2 SV3.7
N$21
  Bottom 0.406: IC9.1 SV3.8
N$22
  Bottom 0.406: IC13.7 SV4.2
N$23
  Bottom 0.406: IC13.6 SV4.3
N$24
  Bottom 0.406: IC13.5 SV4.4
N$25
  Bottom 0.406: IC13.4 SV4.5
N$26
  Bottom 0.406: IC13.3 SV4.6
N$27
  Bottom 0.406: IC13.2 SV4.7
N$28
  Bottom 0.406: IC13.1 SV4.8
N$29
  Bottom 0.406: IC2.1 SV9.8
N$30
  Bottom 0.406: IC2.2 SV9.7
N$31
  Bottom 0.406: IC2.3 SV9.6
N$32
  Bottom 0.406: IC2.4 SV9.5
N$33
  Bottom 0.406: IC2.5 SV9.4
N$34
  Bottom 0.406: IC2.6 SV9.3
N$35
  Bottom 0.406: IC2.7 SV9.2
N$36
  Bottom 0.406: IC6.1 SV10.8
N$37
  Bottom 0.406: IC6.2 SV10.7
N$38
  Bottom 0.406: IC6.3 SV10.6
N$39
  Bottom 0.406: IC6.4 SV10.5
N$40
  Bottom 0.406: IC6.5 SV10.4
N$41
  Bottom 0.406: IC6.6 SV10.3
N$42
  Bottom 0.406: IC6.7 SV10.2
N$43
  Bottom 0.406: IC10.1 SV11.8
N$44
  Bottom 0.406: IC10.2 SV11.7
N$45
  Bottom 0.406: IC10.3 SV11.6
N$46
  Bottom 0.406: IC10.4 SV11.5
N$47
  Bottom 0.406: IC10.5 SV11.4
N$48
  Bottom 0.406: IC10.6 SV11.3
N$49
  Bottom 0.406: IC10.7 SV11.2
N$50
  Bottom 0.406: IC14.1 SV12.8
N$51
  Bottom 0.406: IC14.2 SV12.7
N$52
  Bottom 0.406: IC14.3 SV12.6
N$53
  Bottom 0.406: IC14.4 SV12.5
N$54
  Bottom 0.406: IC14.5 SV12.4
N$55
  Bottom 0.406: IC14.6 SV12.3
N$56
  Bottom 0.406: IC14.7 SV12.2
N$57
  Bottom 0.406: SV15.2 IC6.15
N$58
  Bottom 0.406: SV15.3 IC6.14
N$59
  Bottom 0.406: SV15.4 IC6.13
N$60
  Bottom 0.406: SV15.5 IC6.12
N$61
  Bottom 0.406: SV15.6 IC6.11
N$62
  Bottom 0.406: SV15.7 IC6.10
N$63
  Bottom 0.406: SV15.8 IC6.9
N$64
  Bottom 0.406: SV14.2 IC10.15
N$65
  Bottom 0.406: SV14.3 IC10.14
N$66
  Bottom 0.406: SV14.4 IC10.13
N$67
  Bottom 0.406: SV14.5 IC10.12
N$68
  Bottom 0.406: SV14.6 IC10.11
N$69
  Bottom 0.406: SV14.7 IC10.10
N$70
  Bottom 0.406: SV14.8 IC10.9
N$71
  Bottom 0.406: SV8.8 IC1.9
N$72
  Bottom 0.406: SV8.7 IC1.10
N$73
  Bottom 0.406: SV8.6 IC1.11
N$74
  Bottom 0.406: SV8.5 IC1.12
N$75
  Bottom 0.406: SV8.4 IC1.13
N$76
  Bottom 0.406: SV8.3 IC1.14
N$77
  Bottom 0.406: SV8.2 IC1.15
N$78
  Bottom 0.406: SV7.8 IC5.9
N$79
  Bottom 0.406: SV7.7 IC5.10
N$80
  Bottom 0.406: SV7.6 IC5.11
N$81
  Bottom 0.406: SV7.5 IC5.12
N$82
  Bottom 0.406: SV7.4 IC5.13
N$83
  Bottom 0.406: SV7.3 IC5.14
N$84
  Bottom 0.406: SV7.2 IC5.15
N$85
  Bottom 0.406: SV16.2 IC2.15
N$86
  Bottom 0.406: SV16.3 IC2.14
N$87
  Bottom 0.406: SV16.4 IC2.13
N$88
  Bottom 0.406: SV16.5 IC2.12
N$89
  Bottom 0.406: SV16.6 IC2.11
N$90
  Bottom 0.406: SV16.7 IC2.10
N$91
  Bottom 0.406: SV16.8 IC2.9
N$92
  Bottom 0.406: SV5.2 IC13.15
N$93
  Bottom 0.406: SV5.3 IC13.14
N$94
  Bottom 0.406: SV5.4 IC13.13
N$95
  Bottom 0.406: SV5.5 IC13.12
N$96
  Bottom 0.406: SV5.6 IC13.11
N$97
  Bottom 0.406: SV5.7 IC13.10
N$98
  Bottom 0.406: SV5.8 IC13.9
N$99
  Bottom 0.406: SV6.2 IC9.15
N$100
  Bottom 0.406: SV6.3 IC9.14
N$101
  Bottom 0.406: SV6.4 IC9.13
N$102
  Bottom 0.406: SV6.5 IC9.12
N$103
  Bottom 0.406: SV6.6 IC9.11
N$104
  Bottom 0.406: SV6.7 IC9.10
N$105
  Bottom 0.406: SV6.8 IC9.9
N$106
  Bottom 0.406: SV13.2 IC14.15
N$107
  Bottom 0.406: SV13.3 IC14.14
N$108
  Bottom 0.406: SV13.4 IC14.13
N$109
  Bottom 0.406: SV13.5 IC14.12
N$110
  Bottom 0.406: SV13.6 IC14.11
N$111
  Bottom 0.406: SV13.7 IC14.10
N$112
  Bottom 0.406: SV13.8 IC14.9
N$113
  Bottom 0.406: IC3.7 SV17.2
N$114
  Bottom 0.406: IC3.6 SV17.3
N$115
  Bottom 0.406: IC3.5 SV17.4
N$116
  Bottom 0.406: IC3.4 SV17.5
N$117
  Bottom 0.406: IC3.3 SV17.6
N$118
  Bottom 0.406: IC3.2 SV17.7
N$119
  Bottom 0.406: IC3.1 SV17.8
N$120
  Bottom 0.406: IC7.7 SV18.2
N$121
  Bottom 0.406: IC7.6 SV18.3
N$122
  Bottom 0.406: IC7.5 SV18.4
N$123
  Bottom 0.406: IC7.4 SV18.5
N$124
  Bottom 0.406: IC7.3 SV18.6
N$125
  Bottom 0.406: IC7.2 SV18.7
N$126
  Bottom 0.406: IC7.1 SV18.8
N$127
  Bottom 0.406: IC11.7 SV19.2
N$128
  Bottom 0.406: IC11.6 SV19.3
N$129
  Bottom 0.406: IC11.5 SV19.4
N$130
  Bottom 0.406: IC11.4 SV19.5
N$131
  Bottom 0.406: IC11.3 SV19.6
N$132
  Bottom 0.406: IC11.2 SV19.7
N$133
  Bottom 0.406: IC11.1 SV19.8
N$134
  Bottom 0.406: IC15.7 SV20.2
N$135
  Bottom 0.406: IC15.6 SV20.3
N$136
  Bottom 0.406: IC15.5 SV20.4
N$137
  Bottom 0.406: IC15.4 SV20.5
N$138
  Bottom 0.406: IC15.3 SV20.6
N$139
  Bottom 0.406: IC15.2 SV20.7
N$140
  Bottom 0.406: IC15.1 SV20.8
N$141
  Bottom 0.406: SV21.2 IC15.15
N$142
  Bottom 0.406: SV21.3 IC15.14
N$143
  Bottom 0.406: SV21.4 IC15.13
N$144
  Bottom 0.406: SV21.5 IC15.12
N$145
  Bottom 0.406: SV21.6 IC15.11
N$146
  Bottom 0.406: SV21.7 IC15.10
N$147
  Bottom 0.406: SV21.8 IC15.9
N$148
  Bottom 0.406: SV22.2 IC11.15
N$149
  Bottom 0.406: SV22.3 IC11.14
N$150
  Bottom 0.406: SV22.4 IC11.13
N$151
  Bottom 0.406: SV22.5 IC11.12
N$152
  Bottom 0.406: SV22.6 IC11.11
N$153
  Bottom 0.406: SV22.7 IC11.10
N$154
  Bottom 0.406: SV22.8 IC11.9
N$155
  Bottom 0.406: SV23.2 IC7.15
N$156
  Bottom 0.406: SV23.3 IC7.14
N$157
  Bottom 0.406: SV23.4 IC7.13
N$158
  Bottom 0.406: SV23.5 IC7.12
N$159
  Bottom 0.406: SV23.6 IC7.11
N$160
  Bottom 0.406: SV23.7 IC7.10
N$161
  Bottom 0.406: SV23.8 IC7.9
N$162
  Bottom 0.406: SV24.2 IC3.15
N$163
  Bottom 0.406: SV24.3 IC3.14
N$164
  Bottom 0.406: SV24.4 IC3.13
N$165
  Bottom 0.406: SV24.5 IC3.12
N$166
  Bottom 0.406: SV24.6 IC3.11
N$167
  Bottom 0.406: SV24.7 IC3.10
N$168
  Bottom 0.406: SV24.8 IC3.9
N$169
  Bottom 0.406: U$7.1 21.59,74.3 13.97,74.3 U$2.A2
N$170
  Top 0.406: U$6.1 16.51,74.3 13.97,74.3 U$2.A1
N$171
  Top 0.406: U$6.2 16.51,77.47 13.97,77.47 U$2.B1
N$172
  Bottom 0.406: U$7.2 21.59,77.47 13.97,77.47 U$2.B2
N$173
  Bottom 0.406: U$7.3 21.59,80.64 13.97,80.64 U$2.C2
N$174
  Top 0.406: U$6.3 16.51,80.64 13.97,80.64 U$2.C1
N$175
  Top 0.406: U$6.4 16.51,83.82 13.97,83.82 U$2.D1
N$176
  Bottom 0.406: U$7.4 21.59,83.82 13.97,83.82 U$2.D2
N$177
  Bottom 0.406: U$7.5 21.59,87 13.97,87 U$2.E2
N$178
  Top 0.406: U$6.5 16.51,87 13.97,87 U$2.E1
N$179
  Top 0.406: U$6.6 16.51,90.17 13.97,90.17 U$2.F1
N$180
  Bottom 0.406: U$7.6 21.59,90.17 13.97,90.17 U$2.F2
N$181
  Bottom 0.406: U$7.7 21.59,93.34 13.97,93.34 U$2.H2
N$182
  Top 0.406: U$6.7 16.51,93.34 13.97,93.34 U$2.H1
N$183
  Top 0.406: U$6.8 16.51,96.52 13.97,96.52 U$2.J1
N$184
  Bottom 0.406: U$7.8 21.59,96.52 13.97,96.52 U$2.J2
N$185
  Bottom 0.406: U$7.9 21.59,99.69 13.97,99.69 U$2.K2
N$186
  Top 0.406: U$6.9 16.51,99.69 13.97,99.69 U$2.K1
N$187
  Top 0.406: U$6.10 16.51,102.87 13.97,102.87 U$2.L1
N$188
  Bottom 0.406: U$7.10 21.59,102.87 13.97,102.87 U$2.L2
N$189
  Bottom 0.406: U$7.11 21.59,106.05 13.97,106.05 U$2.M2
N$190
  Top 0.406: U$6.11 16.51,106.05 13.97,106.05 U$2.M1
N$191
  Top 0.406: U$6.12 16.51,109.22 13.97,109.22 U$2.N1
N$192
  Top 0.406: U$6.13 16.51,112.39 13.97,112.39 U$2.P1
N$193
  Bottom 0.406: U$7.13 21.59,112.39 13.97,112.39 U$2.P2
N$194
  Bottom 0.406: U$7.12 21.59,109.22 13.97,109.22 U$2.N2
N$195
  Top 0.406: U$6.18 16.51,128.27 13.97,128.27 U$2.V1
N$196
  Top 0.406: U$6.17 16.51,125.09 13.97,125.09 U$2.U1
N$197
  Top 0.406: U$6.16 16.51,121.92 13.97,121.92 U$2.T1
N$198
  Top 0.406: U$6.15 16.51,118.75 13.97,118.75 U$2.S1
N$199
  Top 0.406: U$6.14 16.51,115.57 13.97,115.57 U$2.R1
N$200
  Bottom 0.406: U$7.18 21.59,128.27 13.97,128.27 U$2.V2
N$201
  Bottom 0.406: U$7.17 21.59,125.09 13.97,125.09 U$2.U2
N$202
  Bottom 0.406: U$7.16 21.59,121.92 13.97,121.92 U$2.T2
N$203
  Bottom 0.406: U$7.15 21.59,118.75 13.97,118.75 U$2.S2
N$204
  Bottom 0.406: U$7.14 21.59,115.57 13.97,115.57 U$2.R2
N$205
  Bottom 0.406: IC4.7 SV25.2
N$206
  Bottom 0.406: IC4.6 SV25.3
N$207
  Bottom 0.406: IC4.5 SV25.4
N$208
  Bottom 0.406: IC4.4 SV25.5
N$209
  Bottom 0.406: IC4.3 SV25.6
N$210
  Bottom 0.406: IC4.2 SV25.7
N$211
  Bottom 0.406: IC4.1 SV25.8
N$212
  Bottom 0.406: IC16.7 SV26.2
N$213
  Bottom 0.406: IC16.6 SV26.3
N$214
  Bottom 0.406: IC16.5 SV26.4
N$215
  Bottom 0.406: IC16.4 SV26.5
N$216
  Bottom 0.406: IC16.3 SV26.6
N$217
  Bottom 0.406: IC16.2 SV26.7
N$218
  Bottom 0.406: IC16.1 SV26.8
N$219
  Bottom 0.406: IC19.7 SV27.2
N$220
  Bottom 0.406: IC19.6 SV27.3
N$221
  Bottom 0.406: IC19.5 SV27.4
N$222
  Bottom 0.406: IC19.4 SV27.5
N$223
  Bottom 0.406: IC19.3 SV27.6
N$224
  Bottom 0.406: IC19.2 SV27.7
N$225
  Bottom 0.406: IC19.1 SV27.8
N$226
  Bottom 0.406: IC22.7 SV28.2
N$227
  Bottom 0.406: IC22.6 SV28.3
N$228
  Bottom 0.406: IC22.5 SV28.4
N$229
  Bottom 0.406: IC22.4 SV28.5
N$230
  Bottom 0.406: IC22.3 SV28.6
N$231
  Bottom 0.406: IC22.2 SV28.7
N$232
  Bottom 0.406: IC22.1 SV28.8
N$233
  Bottom 0.406: IC8.1 SV33.8
N$234
  Bottom 0.406: IC8.2 SV33.7
N$235
  Bottom 0.406: IC8.3 SV33.6
N$236
  Bottom 0.406: IC8.4 SV33.5
N$237
  Bottom 0.406: IC8.5 SV33.4
N$238
  Bottom 0.406: IC8.6 SV33.3
N$239
  Bottom 0.406: IC8.7 SV33.2
N$240
  Bottom 0.406: IC17.1 SV34.8
N$241
  Bottom 0.406: IC17.2 SV34.7
N$242
  Bottom 0.406: IC17.3 SV34.6
N$243
  Bottom 0.406: IC17.4 SV34.5
N$244
  Bottom 0.406: IC17.5 SV34.4
N$245
  Bottom 0.406: IC17.6 SV34.3
N$246
  Bottom 0.406: IC17.7 SV34.2
N$247
  Bottom 0.406: IC20.1 SV35.8
N$248
  Bottom 0.406: IC20.2 SV35.7
N$249
  Bottom 0.406: IC20.3 SV35.6
N$250
  Bottom 0.406: IC20.4 SV35.5
N$251
  Bottom 0.406: IC20.5 SV35.4
N$252
  Bottom 0.406: IC20.6 SV35.3
N$253
  Bottom 0.406: IC20.7 SV35.2
N$254
  Bottom 0.406: IC23.1 SV36.8
N$255
  Bottom 0.406: IC23.2 SV36.7
N$256
  Bottom 0.406: IC23.3 SV36.6
N$257
  Bottom 0.406: IC23.4 SV36.5
N$258
  Bottom 0.406: IC23.5 SV36.4
N$259
  Bottom 0.406: IC23.6 SV36.3
N$260
  Bottom 0.406: IC23.7 SV36.2
N$261
  Bottom 0.406: SV39.2 IC17.15
N$262
  Bottom 0.406: SV39.3 IC17.14
N$263
  Bottom 0.406: SV39.4 IC17.13
N$264
  Bottom 0.406: SV39.5 IC17.12
N$265
  Bottom 0.406: SV39.6 IC17.11
N$266
  Bottom 0.406: SV39.7 IC17.10
N$267
  Bottom 0.406: SV39.8 IC17.9
N$268
  Bottom 0.406: SV38.2 IC20.15
N$269
  Bottom 0.406: SV38.3 IC20.14
N$270
  Bottom 0.406: SV38.4 IC20.13
N$271
  Bottom 0.406: SV38.5 IC20.12
N$272
  Bottom 0.406: SV38.6 IC20.11
N$273
  Bottom 0.406: SV38.7 IC20.10
N$274
  Bottom 0.406: SV38.8 IC20.9
N$275
  Bottom 0.406: SV32.8 IC4.9
N$276
  Bottom 0.406: SV32.7 IC4.10
N$277
  Bottom 0.406: SV32.6 IC4.11
N$278
  Bottom 0.406: SV32.5 IC4.12
N$279
  Bottom 0.406: SV32.4 IC4.13
N$280
  Bottom 0.406: SV32.3 IC4.14
N$281
  Bottom 0.406: SV32.2 IC4.15
N$282
  Bottom 0.406: SV31.8 IC16.9
N$283
  Bottom 0.406: SV31.7 IC16.10
N$284
  Bottom 0.406: SV31.6 IC16.11
N$285
  Bottom 0.406: SV31.5 IC16.12
N$286
  Bottom 0.406: SV31.4 IC16.13
N$287
  Bottom 0.406: SV31.3 IC16.14
N$288
  Bottom 0.406: SV31.2 IC16.15
N$289
  Bottom 0.406: SV40.2 IC8.15
N$290
  Bottom 0.406: SV40.3 IC8.14
N$291
  Bottom 0.406: SV40.4 IC8.13
N$292
  Bottom 0.406: SV40.5 IC8.12
N$293
  Bottom 0.406: SV40.6 IC8.11
N$294
  Bottom 0.406: SV40.7 IC8.10
N$295
  Bottom 0.406: SV40.8 IC8.9
N$296
  Bottom 0.406: SV29.2 IC22.15
N$297
  Bottom 0.406: SV29.3 IC22.14
N$298
  Bottom 0.406: SV29.4 IC22.13
N$299
  Bottom 0.406: SV29.5 IC22.12
N$300
  Bottom 0.406: SV29.6 IC22.11
N$301
  Bottom 0.406: SV29.7 IC22.10
N$302
  Bottom 0.406: SV29.8 IC22.9
N$303
  Bottom 0.406: SV30.2 IC19.15
N$304
  Bottom 0.406: SV30.3 IC19.14
N$305
  Bottom 0.406: SV30.4 IC19.13
N$306
  Bottom 0.406: SV30.5 IC19.12
N$307
  Bottom 0.406: SV30.6 IC19.11
N$308
  Bottom 0.406: SV30.7 IC19.10
N$309
  Bottom 0.406: SV30.8 IC19.9
N$310
  Bottom 0.406: SV37.2 IC23.15
N$311
  Bottom 0.406: SV37.3 IC23.14
N$312
  Bottom 0.406: SV37.4 IC23.13
N$313
  Bottom 0.406: SV37.5 IC23.12
N$314
  Bottom 0.406: SV37.6 IC23.11
N$315
  Bottom 0.406: SV37.7 IC23.10
N$316
  Bottom 0.406: SV37.8 IC23.9
N$317
  Bottom 0.406: IC12.7 SV41.2
N$318
  Bottom 0.406: IC12.6 SV41.3
N$319
  Bottom 0.406: IC12.5 SV41.4
N$320
  Bottom 0.406: IC12.4 SV41.5
N$321
  Bottom 0.406: IC12.3 SV41.6
N$322
  Bottom 0.406: IC12.2 SV41.7
N$323
  Bottom 0.406: IC12.1 SV41.8
N$324
  Bottom 0.406: IC18.7 SV42.2
N$325
  Bottom 0.406: IC18.6 SV42.3
N$326
  Bottom 0.406: IC18.5 SV42.4
N$327
  Bottom 0.406: IC18.4 SV42.5
N$328
  Bottom 0.406: IC18.3 SV42.6
N$329
  Bottom 0.406: IC18.2 SV42.7
N$330
  Bottom 0.406: IC18.1 SV42.8
N$331
  Bottom 0.406: IC21.7 SV43.2
N$332
  Bottom 0.406: IC21.6 SV43.3
N$333
  Bottom 0.406: IC21.5 SV43.4
N$334
  Bottom 0.406: IC21.4 SV43.5
N$335
  Bottom 0.406: IC21.3 SV43.6
N$336
  Bottom 0.406: IC21.2 SV43.7
N$337
  Bottom 0.406: IC21.1 SV43.8
N$338
  Bottom 0.406: IC24.7 SV44.2
N$339
  Bottom 0.406: IC24.6 SV44.3
N$340
  Bottom 0.406: IC24.5 SV44.4
N$341
  Bottom 0.406: IC24.4 SV44.5
N$342
  Bottom 0.406: IC24.3 SV44.6
N$343
  Bottom 0.406: IC24.2 SV44.7
N$344
  Bottom 0.406: IC24.1 SV44.8
N$345
  Bottom 0.406: SV45.2 IC24.15
N$346
  Bottom 0.406: SV45.3 IC24.14
N$347
  Bottom 0.406: SV45.4 IC24.13
N$348
  Bottom 0.406: SV45.5 IC24.12
N$349
  Bottom 0.406: SV45.6 IC24.11
N$350
  Bottom 0.406: SV45.7 IC24.10
N$351
  Bottom 0.406: SV45.8 IC24.9
N$352
  Bottom 0.406: SV46.2 IC21.15
N$353
  Bottom 0.406: SV46.3 IC21.14
N$354
  Bottom 0.406: SV46.4 IC21.13
N$355
  Bottom 0.406: SV46.5 IC21.12
N$356
  Bottom 0.406: SV46.6 IC21.11
N$357
  Bottom 0.406: SV46.7 IC21.10
N$358
  Bottom 0.406: SV46.8 IC21.9
N$359
  Bottom 0.406: SV47.2 IC18.15
N$360
  Bottom 0.406: SV47.3 IC18.14
N$361
  Bottom 0.406: SV47.4 IC18.13
N$362
  Bottom 0.406: SV47.5 IC18.12
N$363
  Bottom 0.406: SV47.6 IC18.11
N$364
  Bottom 0.406: SV47.7 IC18.10
N$365
  Bottom 0.406: SV47.8 IC18.9
N$366
  Bottom 0.406: SV48.2 IC12.15
N$367
  Bottom 0.406: SV48.3 IC12.14
N$368
  Bottom 0.406: SV48.4 IC12.13
N$369
  Bottom 0.406: SV48.5 IC12.12
N$370
  Bottom 0.406: SV48.6 IC12.11
N$371
  Bottom 0.406: SV48.7 IC12.10
N$372
  Bottom 0.406: SV48.8 IC12.9
P1
  Top 0.406: U$3.13 16.51,42.55 13.97,42.55 U$4.P1
P2
  Bottom 0.406: U$5.13 21.59,42.55 13.97,42.55 U$4.P2
R1
  Top 0.406: U$3.14 16.51,45.72 13.97,45.72 U$4.R1
R2
  Bottom 0.406: U$5.14 21.59,45.72 13.97,45.72 U$4.R2
S1
  Top 0.406: U$3.15 16.51,48.9 13.97,48.9 U$4.S1
S2
  Bottom 0.406: U$5.15 21.59,48.9 13.97,48.9 U$4.S2
T1
  Top 0.406: U$3.16 16.51,52.07 13.97,52.07 U$4.T1
T2
  Bottom 0.406: U$5.16 21.59,52.07 13.97,52.07 U$4.T2
U1
  Top 0.406: U$3.17 16.51,55.24 13.97,55.24 U$4.U1
U2
  Bottom 0.406: U$5.17 21.59,55.24 13.97,55.24 U$4.U2
V1
  Top 0.406: U$3.18 16.51,58.42 13.97,58.42 U$4.V1
V2
  Bottom 0.406: U$5.18 21.59,58.42 13.97,58.42 U$4.V2
VCC
  Top 0.406: 40.64,90.17 44.45,90.17 45.72,91.44 | 45.72,91.44 46.99,92.71 SV40.1 IC8.16 53.34,102.87 53.34,110.49 | 40.64,90.17 C15.1 | 45.72,91.44 50.17,91.44 51.44,90.17 C17.1 | 40.64,90.17 40.64,82.55 IC12.16 SV48.1 46.99,61.59 45.72,60.33 45.72,50.8 46.99,49.53 IC3.16 SV24.1 46.99,43.18 | SV31.1 69.85,111.76 73.03,111.76 74.3,110.49 C19.1 83.19,110.49 84.46,109.22 89.54,109.22 | SV31.1 IC16.16 | IC4.16 SV32.1 46.99,111.76 | 45.09,111.76 41.28,111.76 40.01,110.49 C13.1 | 45.09,111.76 46.36,110.49 C14.1 | 53.34,110.49 51.44,110.49 50.17,111.76 46.99,111.76 | 46.99,111.76 45.09,111.76 | 53.34,110.49 C16.1 64.77,110.49 67.31,113.03 SV31.1 | SV47.1 IC18.16 73.66,82.55 73.66,90.81 | 67.31,91.44 C18.1 | 67.31,91.44 SV39.1 IC17.16 | 73.66,90.81 73.03,91.44 67.31,91.44 | 73.66,90.81 74.3,90.17 C21.1 87.63,90.17 90.17,92.71 | IC23.16 SV37.1 110.49,113.03 107.95,110.49 C22.1 94.62,110.49 93.35,111.76 90.17,111.76 | 90.17,111.76 C20.1 90.17,109.86 89.54,109.22 | 90.17,111.76 SV45.1 IC24.16 | IC22.16 SV29.1 C24.1 110.49,89.53 109.22,88.27 109.22,77.47 | SV46.1 IC21.16 109.22,77.47 | SV30.1 IC19.16 95.89,81.92 | 96.52,90.17 94.62,90.17 93.35,91.44 91.44,91.44 90.17,92.71 | 96.52,90.17 C23.1 | 95.89,81.92 96.52,82.55 96.52,90.17 | 109.22,77.47 104.78,81.92 95.89,81.92 | 89.54,109.22 88.9,108.58 88.9,99.06 90.17,97.79 IC20.16 SV38.1 90.17,92.71 | SV8.1 IC1.16 40.64,13.97 40.64,21.59 | 40.64,21.59 44.45,21.59 45.72,22.86 | 45.72,22.86 46.99,24.13 SV16.1 IC2.16 53.34,34.29 53.34,41.91 | 40.64,21.59 C1.1 34.29,20.95 33.02,19.68 33.02,13.97 27.94,8.89 27.94,8.26 24.13,4.45 U$5.1 | 45.72,22.86 50.17,22.86 51.44,21.59 C2.1
  Top 0.406: SV23.1 69.85,43.18 73.03,43.18 74.3,41.91 C11.1 83.19,41.91 84.46,40.64 89.54,40.64 | SV23.1 IC7.16 | 45.09,43.18 41.28,43.18 40.01,41.91 C9.1 | 45.09,43.18 46.36,41.91 C5.1 | 53.34,41.91 51.44,41.91 50.17,43.18 46.99,43.18 | 46.99,43.18 45.09,43.18 | 53.34,41.91 C10.1 64.77,41.91 67.31,44.45 SV23.1 | SV7.1 IC5.16 73.66,13.97 73.66,22.23 | 67.31,22.86 C6.1 | 67.31,22.86 SV15.1 IC6.16 | 73.66,22.23 73.03,22.86 67.31,22.86 | 73.66,22.23 74.3,21.59 C3.1 87.63,21.59 90.17,24.13 | IC15.16 SV21.1 110.49,44.45 107.95,41.91 C12.1 94.62,41.91 93.35,43.18 90.17,43.18 | 90.17,43.18 C7.1 90.17,41.27 89.54,40.64 | 90.17,43.18 SV22.1 IC11.16 | IC14.16 SV13.1 C8.1 110.49,20.95 109.22,19.68 109.22,8.89 | SV5.1 IC13.16 109.22,8.89 | SV6.1 IC9.16 95.89,13.34 | 96.52,21.59 94.62,21.59 93.35,22.86 91.44,22.86 90.17,24.13 | 96.52,21.59 C4.1 | 95.89,13.34 96.52,13.97 96.52,21.59 | 109.22,8.89 104.78,13.34 95.89,13.34 | 89.54,40.64 88.9,40.01 88.9,30.48 90.17,29.21 IC10.16 SV14.1 90.17,24.13
  Bottom 0.406: U$4.A2 13.97,4.45 21.59,4.45 U$5.1

### Text on the board
Top: VRS | 8i/8L Prototype
Bottom: VRS | 8i/8L Prototype
tPlace: 8i/8L Prototype